# Altium schematic sheet MCU.SchDoc
size A3; SheetNumber: 4; SheetTotal: 7
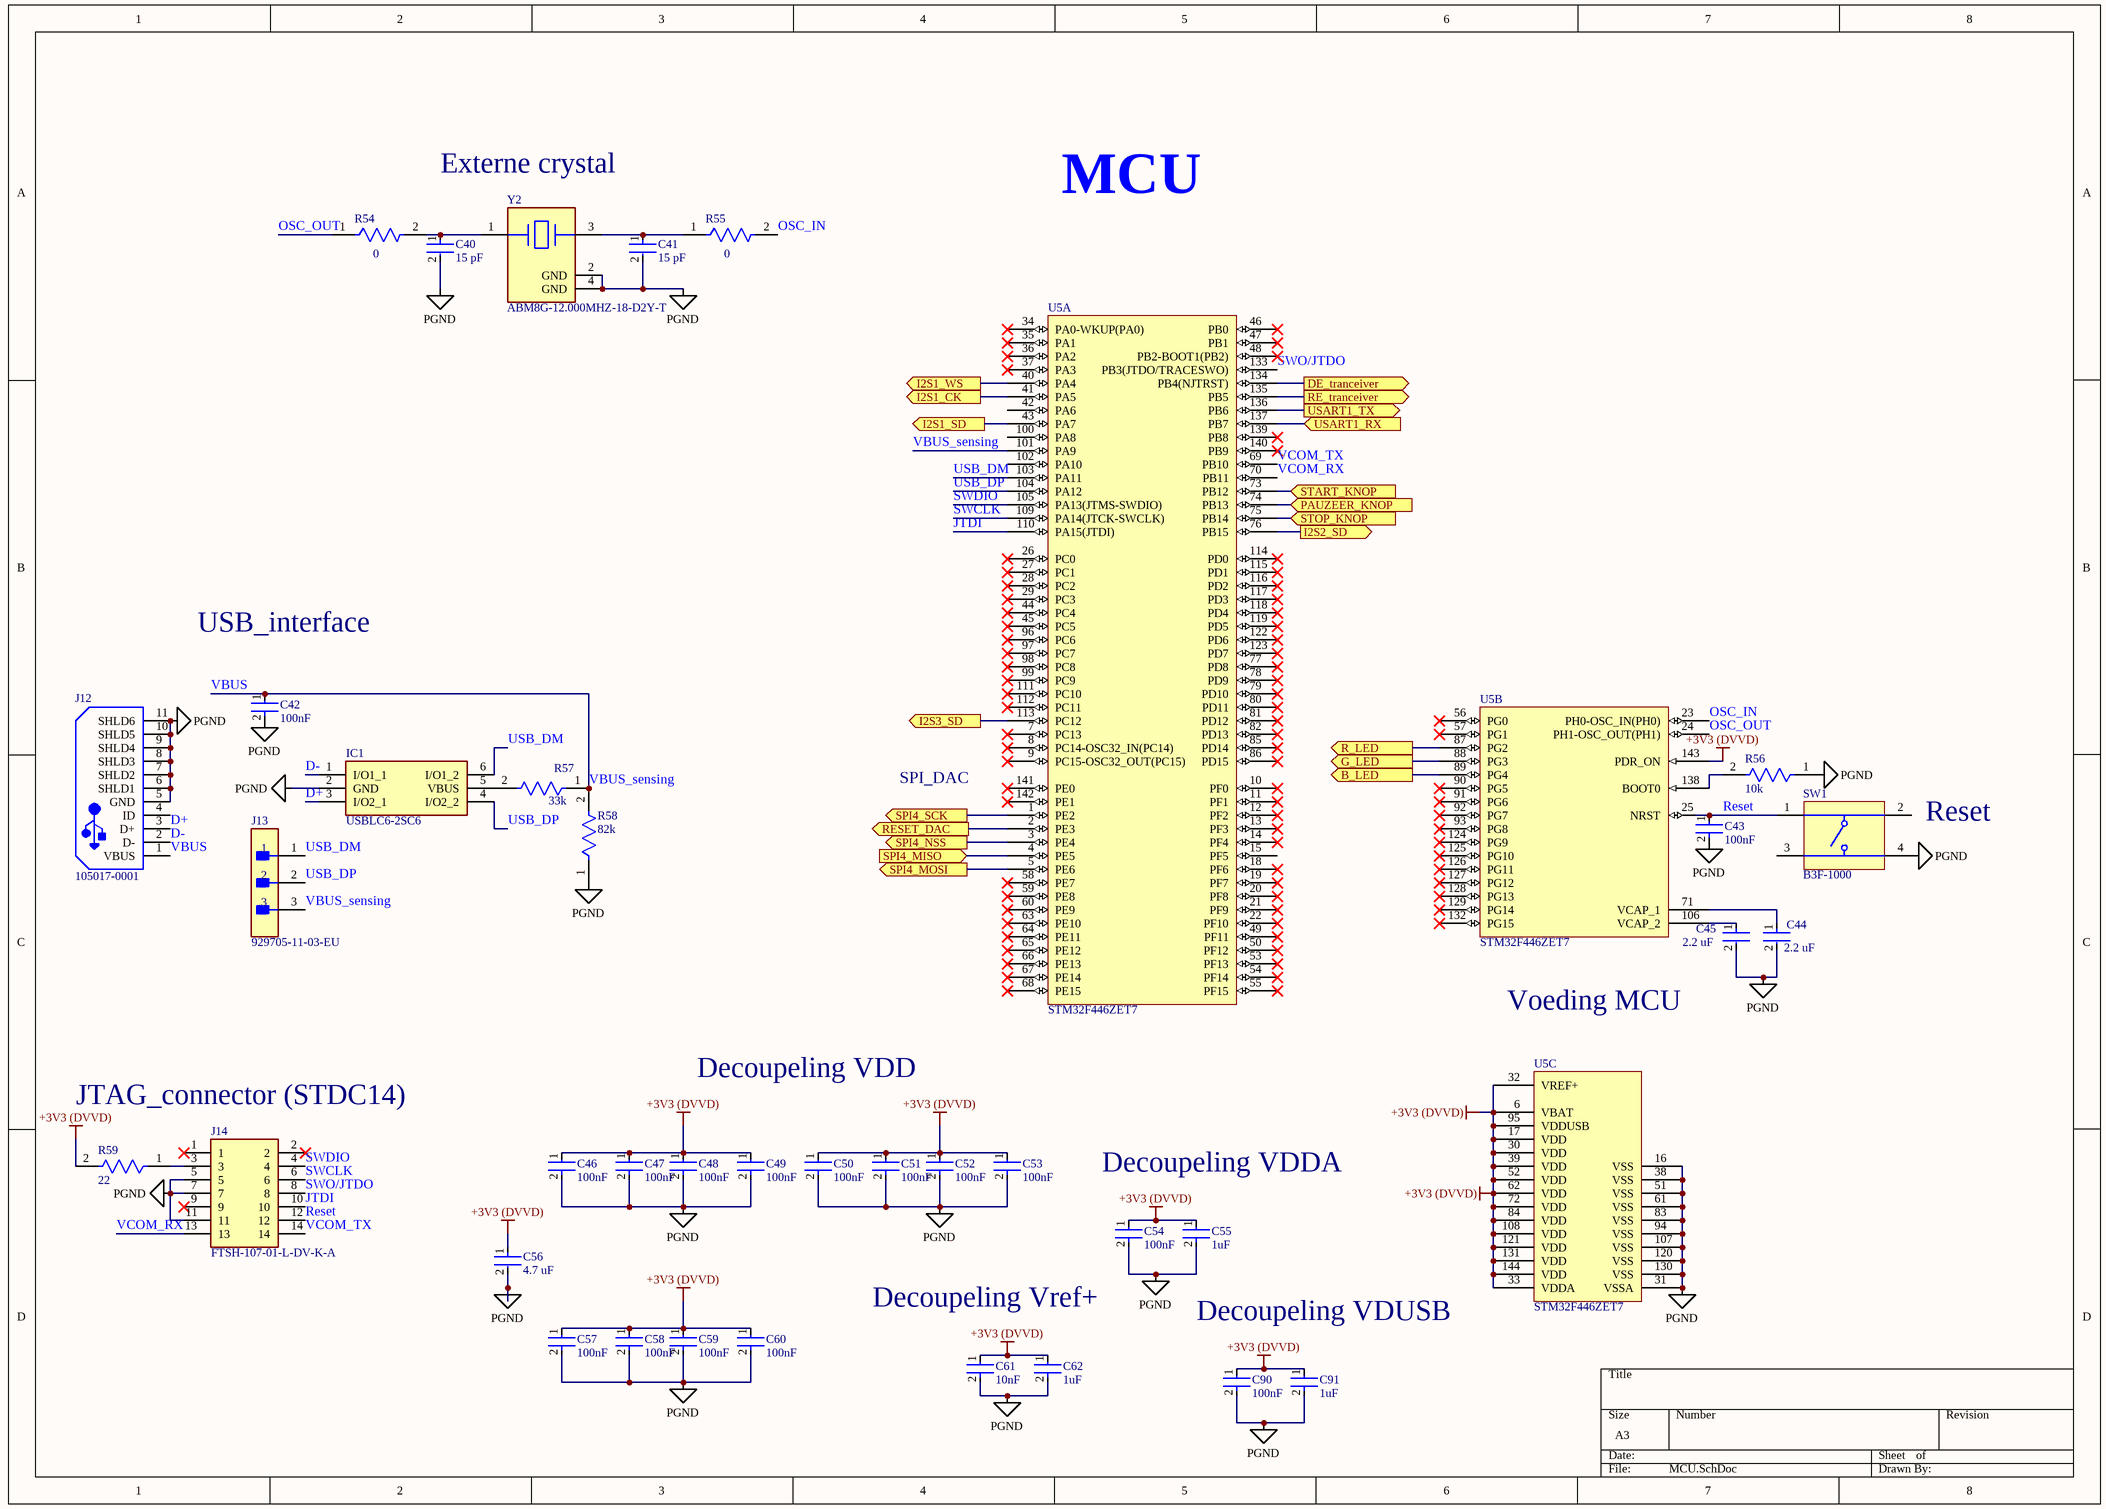
[diagram p0: MCU.SchDoc]

## Parts
C40  15 pF  [FP-AC0603-MFG]
C41  15 pF  [FP-AC0603-MFG]
C42  100nF  [FP-GRM15-MFG]
C43  100nF  [FP-GRM15-MFG]
C44  2.2 uF  [FP-C0603C-CF-MFG]
C45  2.2 uF  [FP-C0603C-CF-MFG]
C46  100nF  [FP-GRM15-MFG]
C47  100nF  [FP-GRM15-MFG]
C48  100nF  [FP-GRM15-MFG]
C49  100nF  [FP-GRM15-MFG]
C50  100nF  [FP-GRM15-MFG]
C51  100nF  [FP-GRM15-MFG]
C52  100nF  [FP-GRM15-MFG]
C53  100nF  [FP-GRM15-MFG]
C54  100nF  [FP-GRM15-MFG]
C55  1uF  [FP-GRM15-MFG]
C56  4.7 uF  [FP-C0603C-CF-MFG]
C57  100nF  [FP-GRM15-MFG]
C58  100nF  [FP-GRM15-MFG]
C59  100nF  [FP-GRM15-MFG]
C60  100nF  [FP-GRM15-MFG]
C61  10nF  [FP-GRM15-MFG]
C62  1uF  [FP-GRM15-MFG]
C90  100nF  [FP-GRM15-MFG]
C91  1uF  [FP-GRM15-MFG]
IC1  USBLC6-2SC6  [SOT95P280X145-6N]
J12  105017-0001  [USB-MICRO-B_V]
J13  929705-11-03-EU  [FP-929705-11-03-EU-MFG]
J14  FTSH-107-01-L-DV-K-A  [FTSH-107-XX-YYY-DV-K-A]
R54  0  [FP-CRCW1206-MFG]
R55  0  [FP-CRCW1206-MFG]
R56  10k  [FP-RC1608-IPC_B]
R57  33k  [FP-RC1608-IPC_B]
R58  82k  [FP-RC1608-IPC_B]
R59  22  [FP-RC1608-IPC_B]
SW1  B3F-1000  [OMRON-B3F-1000-4_V]
U5  STM32F446ZET7  [STM-LQFP144_M]  (parts A,B,C of 3)
Y2  ABM8G-12.000MHZ-18-D2Y-T  [FP-ABM8G-MFG]

## Ports
B_LED (out, see TOP_scheet[3C]), DE_tranceiver (out, see TOP_scheet[3C]), G_LED (out, see TOP_scheet[3C]), I2S1_CK (out, see TOP_scheet[3B]), I2S1_SD (out, see TOP_scheet[3B], DAC[1C]), I2S1_WS (out, see TOP_scheet[3B]), I2S2_SD (out, see TOP_scheet[3B], DAC[1C]), I2S3_SD (out, see TOP_scheet[3B], DAC[1C]), PAUZEER_KNOP (in, see TOP_scheet[2B]), R_LED (out, see TOP_scheet[3C]), RE_tranceiver (out, see TOP_scheet[3C]), RESET_DAC (out, see TOP_scheet[2B]), SPI4_MISO (in, see TOP_scheet[3C]), SPI4_MOSI (out, see TOP_scheet[3C]), SPI4_NSS (out, see TOP_scheet[3C]), SPI4_SCK (out, see TOP_scheet[3B]), START_KNOP (in, see TOP_scheet[2B]), STOP_KNOP (in, see TOP_scheet[2B]), USART1_RX (in, see TOP_scheet[2C]), USART1_TX (out, see TOP_scheet[3C])

## Nets
+3V3 (DVVD): C46.1 C47.1 C48.1 C49.1 C50.1 C51.1 C52.1 C53.1 C54.1 C55.1 C56.1 C57.1 C58.1 C59.1 C60.1 C61.1 C62.1 C90.1 C91.1 R59.2 U5.6(VBAT) U5.17(VDD) U5.30(VDD) U5.32(VREF+) U5.33(VDDA) U5.39(VDD) U5.52(VDD) U5.62(VDD) U5.72(VDD) U5.84(VDD) U5.95(VDDUSB) U5.108(VDD) U5.121(VDD) U5.131(VDD) U5.143(PDR_ON) U5.144(VDD)
PGND: C40.2 C41.2 C42.2 C43.2 C44.2 C45.2 C46.2 C47.2 C48.2 C49.2 C50.2 C51.2 C52.2 C53.2 C54.2 C55.2 C56.2 C57.2 C58.2 C59.2 C60.2 C61.2 C62.2 C90.2 C91.2 IC1.2(GND) J12.5(GND) J12.6(SHLD1) J12.7(SHLD2) J12.8(SHLD3) J12.9(SHLD4) J12.10(SHLD5) J12.11(SHLD6) J14.5 J14.7 J14.11 R56.1 R58.1 SW1.4 U5.16(VSS) U5.31(VSSA) U5.38(VSS) U5.51(VSS) U5.61(VSS) U5.83(VSS) U5.94(VSS) U5.107(VSS) U5.120(VSS) U5.130(VSS) Y2.2(GND) Y2.4(GND)
B_LED: U5.89(PG4) ; port B_LED
D+: IC1.3(I/O2_1) J12.3(D+)
D-: IC1.1(I/O1_1) J12.2(D-)
DE_tranceiver: U5.134(PB4(NJTRST)) ; port DE_tranceiver
G_LED: U5.88(PG3) ; port G_LED
I2S1_CK: U5.41(PA5) ; port I2S1_CK
I2S1_SD: U5.43(PA7) ; port I2S1_SD
I2S1_WS: U5.40(PA4) ; port I2S1_WS
I2S2_SD: U5.76(PB15) ; port I2S2_SD
I2S3_SD: U5.113(PC12) ; port I2S3_SD
JTDI: J14.10 U5.110(PA15(JTDI))
OSC_IN: R55.2 U5.23(PH0-OSC_IN(PH0))
OSC_OUT: R54.1 U5.24(PH1-OSC_OUT(PH1))
PAUZEER_KNOP: U5.74(PB13) ; port PAUZEER_KNOP
R_LED: U5.87(PG2) ; port R_LED
RE_tranceiver: U5.135(PB5) ; port RE_tranceiver
Reset: C43.1 J14.12 SW1.1 U5.25(NRST)
RESET_DAC: U5.2(PE3) ; port RESET_DAC
SPI4_MISO: U5.4(PE5) ; port SPI4_MISO
SPI4_MOSI: U5.5(PE6) ; port SPI4_MOSI
SPI4_NSS: U5.3(PE4) ; port SPI4_NSS
SPI4_SCK: U5.1(PE2) ; port SPI4_SCK
START_KNOP: U5.73(PB12) ; port START_KNOP
STOP_KNOP: U5.75(PB14) ; port STOP_KNOP
SWCLK: J14.6 U5.109(PA14(JTCK-SWCLK))
SWDIO: J14.4 U5.105(PA13(JTMS-SWDIO))
SWO/JTDO: J14.8 U5.133(PB3(JTDO/TRACESWO))
USART1_RX: U5.137(PB7) ; port USART1_RX
USART1_TX: U5.136(PB6) ; port USART1_TX
USB_DM: IC1.6(I/O1_2) J13.1 U5.103(PA11)
USB_DP: IC1.4(I/O2_2) J13.2 U5.104(PA12)
VBUS: C42.1 J12.1(VBUS) J13.3 R57.1 R58.2 U5.101(PA9)  [also labelled VBUS_sensing]
VCOM_RX: J14.13 U5.70(PB11)
VCOM_TX: J14.14 U5.69(PB10)
NetC40_1: C40.1 R54.2 Y2.1
NetC41_1: C41.1 R55.1 Y2.3
NetC44_1: C44.1 U5.71(VCAP_1)
NetC45_1: C45.1 U5.106(VCAP_2)
NetIC1_5: IC1.5(VBUS) R57.2
NetJ14_3: J14.3 R59.1
NetR56_2: R56.2 U5.138(BOOT0)

Not connected (* = marked no-connect by the designer): J12 4(ID); J14 1* 2* 9*; SW1 2 3; U5 7(PC13)* 8(PC14-OSC32_IN(PC14))* 9(PC15-OSC32_OUT(PC15))* 10(PF0)* 11(PF1)* 12(PF2)* 13(PF3)* 14(PF4)* 15(PF5) 18(PF6)* 19(PF7)* 20(PF8)* 21(PF9)* 22(PF10)* 26(PC0)* 27(PC1)* 28(PC2)* 29(PC3)* 34(PA0-WKUP(PA0))* 35(PA1)* 36(PA2)* 37(PA3)* 42(PA6) 44(PC4)* 45(PC5)* 46(PB0)* 47(PB1)* 48(PB2-BOOT1(PB2))* 49(PF11)* 50(PF12)* 53(PF13)* 54(PF14)* 55(PF15)* 56(PG0)* 57(PG1)* 58(PE7)* 59(PE8)* 60(PE9)* 63(PE10)* 64(PE11)* 65(PE12)* 66(PE13)* 67(PE14)* 68(PE15)* 77(PD8)* 78(PD9)* 79(PD10)* 80(PD11)* 81(PD12)* 82(PD13)* 85(PD14)* 86(PD15)* 90(PG5)* 91(PG6)* 92(PG7)* 93(PG8)* 96(PC6)* 97(PC7)* 98(PC8)* 99(PC9)* 100(PA8) 102(PA10) 111(PC10)* 112(PC11)* 114(PD0)* 115(PD1)* 116(PD2)* 117(PD3)* 118(PD4)* 119(PD5)* 122(PD6)* 123(PD7)* 124(PG9)* 125(PG10)* 126(PG11)* 127(PG12)* 128(PG13)* 129(PG14)* 132(PG15)* 139(PB8)* 140(PB9)* 141(PE0)* 142(PE1)*

## Notes on the sheet
- Externe crystal
- MCU
- USB_interface
- SPI_DAC
- (near SW1) Reset
- Voeding MCU
- JTAG_connector (STDC14)
- Decoupeling VDD
- Decoupeling VDDA
- Decoupeling Vref+
- Decoupeling VDUSB

## Library data of the parts
C40 C41 = CMP-03422-001062-1: AC0603 15 pF NP0 5.00% 50 V; Manufacturer Part Number: AC0603JRNPO9BN271; Manufacturer: Yageo; Generic part Eurocircuits:: GPC0603150; Material: Ceramic; Value: 30 pF; Tolerance: 0.05; Voltage Rating: 50 V; Temperature Coefficient: 15%; Automotive Grade: Grade 1; ComponentLink2URL: http://www.yageo.com/documents/recent/UPY-AC_NP0X7R_16V-to-630V_12.pdf; Capacitance: 30 pF; Lead Free: Yes; Automotive: Yes; Package: AC0603; RoHS: TRUE; Device Class L2: Capacitors; Footprint Url: http://www.yageo.com/exep/pages/download/literatures/UPY-C_GEN_24.pdf; Height: 0.9mm; Category: Cap; Device Class L1: Passive Components; Temperature: -55°C to +125°C; Ipc Land Pattern Name: CAPC16080X80; Octopart: https://octopart.com/ac0603jrnpo9bn271-yageo-87214073; ComponentLink2Description: Datasheet; Device Class L3: Ceramic Capacitors; Temperature Characteristic: NP0; Temperature Range High: +125°C; Temperature Range Low: -55°C
C42 C43 C46-C54 C57-C60 C90 = CMP-2100-03641-2: CAP CER 0.1UF 16V X7R 0402; Manufacturer Part Number: GRM155R71C104KA88D; Manufacturer: Murata; Eurocircuits generic parts: GPC0402104; Standoff Height: 0mm; Tolerance: 10%; Voltage Rating: 16Vdc; Material: Ceramic; Capacitance: 0.10μF; Value: 0.10μF; RoHS: TRUE; Temperature Characteristic: X7R; Octopart: https://octopart.com/grm155r71c104ka88d-murata-196880; Digikey Description: CAP CER 0.1UF 16V X7R 0402; Device Class L3: Ceramic Capacitors; Height: 0.55mm; ComponentLink2Description: Datasheet; Temperature Range Low: -55°C; Ipc Land Pattern Name: CAPC10050X219; ComponentLink2URL: https://search.murata.co.jp/Ceramy/image/img/A01X/G101/ENG/GRM155R71H471KA01-01A.pdf; Device Class L1: Passive Components; Lead Free: yes; Category: Cap; Package: GRM15; Temperature: -55°C to +125°C; Device Class L2: Capacitors; Temperature Range High: +125°C; Mouser Description: 0402 0.1 uF 16V ±10 % Tolerance X7R SMT Multilayer Ceramic Capacitor
C44 C45 = CMP-2006-03056-2: CAP CER 2.2 UF 50V 5% X7R 0603; Manufacturer Part Number: C0603C104J5RACTU; Manufacturer: KEMET; Generic part Eurocircuits:: GPC0603225-10; Automotive Grade: Grade 1; Tolerance: 0.05; Capacitance: 2.2 μF; Value: 2.2 μF; Material: Ceramic; Temperature Coefficient: 30ppm/°C; ComponentLink2Description: Datasheet; Voltage Rating: 50 V; Digikey Description: CAP CER 0.1UF 50V 5% X7R 0603; Temperature Range High: +125°C; Device Class L2: Capacitors; Octopart: https://octopart.com/c0603c104j5ractu-kemet-10440638; RoHS: TRUE; Mouser Description: Multilayer Ceramic Capacitors MLCC - SMD/SMT 50volts 0.1uF X7R 5%; Temperature Range Low: -55°C; Automotive: Yes; Lead Free: Yes; ComponentLink2URL: https://api.kemet.com/component-edge/download/datasheet/C0603C100J5GACAUTO.pdf; Device Class L3: Ceramic Capacitors; Package: C0603C-CF; Category: Cap; Temperature: -55°C to +125°C; Height: 0.87mm; Temperature Characteristic: X7R; Device Class L1: Passive Components
C55 C62 C91 = CMP-2100-03641-2: CAP CER 1UF 16V X7R 0402; Manufacturer Part Number: GRM155R71C104KA88D; Manufacturer: Murata; Eurocircuits generic parts: GPC0402105-16; Standoff Height: 0mm; Tolerance: 10%; Voltage Rating: 16Vdc; Material: Ceramic; Capacitance: 1μF; Value: 1μF; RoHS: TRUE; Temperature Characteristic: X7R; Octopart: https://octopart.com/grm155r71c104ka88d-murata-196880; Digikey Description: CAP CER 0.1UF 16V X7R 0402; Device Class L3: Ceramic Capacitors; Height: 0.55mm; ComponentLink2Description: Datasheet; Temperature Range Low: -55°C; Ipc Land Pattern Name: CAPC10050X219; ComponentLink2URL: https://search.murata.co.jp/Ceramy/image/img/A01X/G101/ENG/GRM155R71H471KA01-01A.pdf; Device Class L1: Passive Components; Lead Free: yes; Category: Cap; Package: GRM15; Temperature: -55°C to +125°C; Device Class L2: Capacitors; Temperature Range High: +125°C; Mouser Description: 0402 0.1 uF 16V ±10 % Tolerance X7R SMT Multilayer Ceramic Capacitor
C56 = CMP-2006-03056-2: CAP CER 4.7 UF 50V 5% X7R 0603; Manufacturer Part Number: C0603C104J5RACTU; Manufacturer: KEMET; Generic part Eurocircuits:: GPC0603475-10; Automotive Grade: Grade 1; Tolerance: 0.05; Capacitance: 4.7 μF; Value: 4.7 μF; Material: Ceramic; Temperature Coefficient: 30ppm/°C; ComponentLink2Description: Datasheet; Voltage Rating: 50 V; Digikey Description: CAP CER 0.1UF 50V 5% X7R 0603; Temperature Range High: +125°C; Device Class L2: Capacitors; Octopart: https://octopart.com/c0603c104j5ractu-kemet-10440638; RoHS: TRUE; Mouser Description: Multilayer Ceramic Capacitors MLCC - SMD/SMT 50volts 0.1uF X7R 5%; Temperature Range Low: -55°C; Automotive: Yes; Lead Free: Yes; ComponentLink2URL: https://api.kemet.com/component-edge/download/datasheet/C0603C100J5GACAUTO.pdf; Device Class L3: Ceramic Capacitors; Package: C0603C-CF; Category: Cap; Temperature: -55°C to +125°C; Height: 0.87mm; Temperature Characteristic: X7R; Device Class L1: Passive Components
C61 = CMP-2100-03641-2: CAP CER 10nF 16V X7R 0402; Manufacturer Part Number: GRM155R71C104KA88D; Manufacturer: Murata; Eurocircuits generic parts: GPC0402103; Standoff Height: 0mm; Tolerance: 10%; Voltage Rating: 16Vdc; Material: Ceramic; RoHS: TRUE; Temperature Characteristic: X7R; Octopart: https://octopart.com/grm155r71c104ka88d-murata-196880; Digikey Description: CAP CER 0.1UF 16V X7R 0402; Device Class L3: Ceramic Capacitors; Height: 0.55mm; ComponentLink2Description: Datasheet; Temperature Range Low: -55°C; Ipc Land Pattern Name: CAPC10050X219; ComponentLink2URL: https://search.murata.co.jp/Ceramy/image/img/A01X/G101/ENG/GRM155R71H471KA01-01A.pdf; Device Class L1: Passive Components; Lead Free: yes; Category: Cap; Package: GRM15; Temperature: -55°C to +125°C; Device Class L2: Capacitors; Capacitance: 10nF; Value: 10nF; Temperature Range High: +125°C; Mouser Description: 0402 0.1 uF 16V ±10 % Tolerance X7R SMT Multilayer Ceramic Capacitor; Parameter 1: *
IC1 = USBLC6-2SC6: ESD-onderdrukkers/TVS-diodes ESD Protection Low Cap; Manufacturer_Name: STMicroelectronics; Bedrijfsspanning:: 5.25 V; Klemspanning:: 17 V; Doorslagspanning:: 6 V; Datasheet Link: http://www.st.com/st-web-ui/static/active/en/resource/technical/document/datasheet/CD00050750.pdf; Height: 1.45mm; Manufacturer_Part_Number: USBLC6-2SC6; Mouser Part Number: 511-USBLC6-2SC6; Mouser Price/Stock: https://www.mouser.co.uk/ProductDetail/STMicroelectronics/USBLC6-2SC6?qs=po45yt2pPpu%2FhNIlwQdTlg%3D%3D; Arrow Part Number: USBLC6-2SC6; Arrow Price/Stock: https://www.arrow.com/en/products/usblc6-2sc6/stmicroelectronics?region=nac
J12 = CMP-2000-05827-1: Micro-USB B Receptacle, Right Angle, Bottom Mount, Surface Mount, with Solder Tabs, -30 to 85 degC, 5-Pin USB, RoHS, Tape and Reel; Manufacturer: Molex; Featured Product: Micro-USBConnectorsUSBConnectors; Other Names: WM1399DKR; Package Version: Rev. F, 12/2012; Number of Contacts: 5; Connector Type: USB-microB; Catalog Drawings: 1050170001; 3D Model: 105017-0001.stp; Mating Products: WM17145-ND-CABLEMICROUSBBTOSTDA1.0MWM17147-ND-CABLEMICROUSBBTOSTDA2.0MWM17146-ND-CABLEMICROUSBBTOSTDA1.5M; PCN Assembly/Origin: ResinSupplier21/Oct/2015; Voltage - Max: 30V; Online Catalog: Molex-MicroUSB; Manufacturer URL: http://www.molex.com/; Package Description: 5-Leads USB, Micro B, Body 7.5 x 5 mm, Pitch 0.65 mm; Datasheet URL: http://www.molex.com/elqNow/elqRedir.htm?ref=http://www.molex.com/webdocs/datasheets/pdf/en-us/1050170001_IO_CONNECTORS.pdf; Ingress Protection: -; Datasheet Version: 03/2016; Mounting Type: BoardCutout,SurfaceMount,RightAngle; Circuits: 5; Standard Package: 1; Package Reference: MICRO-B; Package URL: http://www.molex.com/pdm_docs/sd/1050170001_sd.pdf; Category: Connectors,Interconnects; Series: -; RoHS Information: 1050170001CertofCompliance; Features: Shielded,SolderRetention; Family: USB,DVI,HDMIConnectors; Specifications: -; Gender: Receptacle; Packaging: Digi-Reel®; Mounting Technology: SurfaceMount
J13 = CMP-05379-000017-1: CONN HEADER VERT 3POS 2.54MM / Euro circruits generic component: / GPHA-1X03; Gender: Male; Connector Type: Male Pin; Current Rating: 2.5A; Voltage Rating: 1.5kV; Number of Positions: 3; Orientation: Straight; Color: Black; Contact Material: Copper Alloy; Housing Color: Black; Series: 929; Contact Plating: Gold; Depth: 2.92mm; Max Current Rating: 2.5A; Mount: Through Hole; Number of Rows: 1; Min Operating Temperature: -40°C; Termination: Solder; Package Quantity: 100; Max Operating Temperature: 105°C; Contact Gender: Male; Length: 7.6mm; Contact Type: Male Pin; Contact Mating Length: 0.318inch; Housing Material: Polycyclohexylenedimethylene; Pitch: 2.54mm; RoHS Compliant: Yes; Packaging: Bulk; Eurocircuits_generic_part_number: GPHA-1X03
J14 = FTSH-107-01-L-DV-K-A: Board Connector, 14 Contact(s), 2 Row(s), Male, Straight, 0.05 inch Pitch, Surface Mount Terminal, Locking, Receptacle; Manufacturer_Name: SAMTEC; Pitch: 1.27mm; Number of Contacts: 14; Datasheet Link: http://suddendocs.samtec.com/prints/ftsh-1xx-xx-xxx-dv-xxx-xxx-mkt.pdf; Manufacturer_Part_Number: FTSH-107-01-L-DV-K-A; Mouser Part Number: 200-FTSH10701LDVKA; Mouser Price/Stock: https://www.mouser.co.uk/ProductDetail/Samtec/FTSH-107-01-L-DV-K-A?qs=PB6%2FjmICvI3xEHFou4PhNg%3D%3D; Arrow Part Number: FTSH-107-01-L-DV-K-A; Arrow Price/Stock: https://www.arrow.com/en/products/ftsh-107-01-l-dv-k-a/samtec?region=europe; Gender: Male
R54 R55 = CMP-00030-39388935-1: CRCW12060000ZSTA Zero Ohm Resistor, Jumper, 1206 [3216 Metric], Thick Film, 250 mW, Surface Mount; Voltage Rating (DC): 200V; Max Power Dissipation: 250mW; Temperature Coefficient: 100ppm/°C; Resistance: 0Ω; Packaging: Cut Tape; Lead Free: Contains Lead; Height: 609.6µm; Military Standard: Not; Min Operating Temperature: -55°C; Weight: 10.007382mg; Depth: 1.6mm; Termination: SMD/SMT; Mount: Surface Mount; RoHS: Compliant; Case Code (Metric): 3216; Max Operating Temperature: 155°C; NexarPartId: 39388935; Length: 3.2mm; Features: Automotive AEC-Q200; Case Code (Imperial): 1206; Composition: Thick Film; Case/Package: 1206; Voltage Rating: 200V; Width: 1.6mm; Contact Plating: Lead, Tin; Number of Terminations: 2; REACH SVHC: Unknown; Power Rating: 250mW; Radiation Hardening: No
R56 = CMP-13261-004935-1: Res Thick Film 0603 10kΩ 1% 0.1W ±100ppm/°C Molded SMD T/R / Generic part Eurocircuits: / GPR060310K; Voltage Rating (DC): 50V; Power Rating: 100mW; Resistance: 10k; Contact Plating: Tin; Depth: 0.8mm; Width: 800um; Tolerance: 1%; Lead Free: Lead Free; Composition: Thick Film; Military Standard: Not; Temperature Coefficient: 100ppm/°C; Radiation Hardening: No; Length: 1.6mm; Case/Package: 0603; Max Operating Temperature: 155°C; Packaging: Tape and Reel; Min Operating Temperature: -55°C; Generic part Eurocircuits:: GPR060310K
R57 = CMP-13261-004935-1: Res Thick Film 0603 33kΩ 1% 0.1W ±100ppm/°C Molded SMD T/R / Generic part Eurocircuits: / GPR060310K; Generic part Eurocircuits:: GPR060333K; Voltage Rating (DC): 50V; Power Rating: 100mW; Resistance: 33k; Contact Plating: Tin; Depth: 0.8mm; Width: 800um; Tolerance: 1%; Lead Free: Lead Free; Composition: Thick Film; Military Standard: Not; Temperature Coefficient: 100ppm/°C; Radiation Hardening: No; Length: 1.6mm; Case/Package: 0603; Max Operating Temperature: 155°C; Packaging: Tape and Reel; Min Operating Temperature: -55°C
R58 = CMP-13261-004935-1: Res Thick Film 0603 82kΩ 1% 0.1W ±100ppm/°C Molded SMD T/R / Generic part Eurocircuits: / GPR060310K; Generic part Eurocircuits:: GPR060382K; Voltage Rating (DC): 50V; Power Rating: 100mW; Resistance: 82k; Contact Plating: Tin; Depth: 0.8mm; Width: 800um; Tolerance: 1%; Lead Free: Lead Free; Composition: Thick Film; Military Standard: Not; Temperature Coefficient: 100ppm/°C; Radiation Hardening: No; Length: 1.6mm; Case/Package: 0603; Max Operating Temperature: 155°C; Packaging: Tape and Reel; Min Operating Temperature: -55°C
R59 = CMP-13261-004935-1: Res Thick Film 0603 22Ω 1% 0.1W ±100ppm/°C Molded SMD T/R / Generic part Eurocircuits: / GPR060310K; Generic part Eurocircuits:: GPR060322R; Voltage Rating (DC): 50V; Power Rating: 100mW; Resistance: 22; Contact Plating: Tin; Depth: 0.8mm; Width: 800um; Tolerance: 1%; Lead Free: Lead Free; Composition: Thick Film; Military Standard: Not; Temperature Coefficient: 100ppm/°C; Radiation Hardening: No; Length: 1.6mm; Case/Package: 0603; Max Operating Temperature: 155°C; Packaging: Tape and Reel; Min Operating Temperature: -55°C
SW1 = CMP-1677-00002-1: Tactile Switch, SPST-NO, 0.05 A, 5 to 24 V, -25 to 70 degC, 4-Pin THD, RoHS, Bulk; Shielding: Shielded; Gender: Female; Capacitance: -45 f; Voltage Rating: 150 V; Current Rating: 1.5 A; Radiation Hardening: No; Contact Plating: Gold; Height: 14.99 mm; Min Operating Temperature: -40 degC; Packaging: Tray; ComponentLink2Description: Datasheet; ComponentLink1URL: http://www.omron.com/; Lead Pitch: 1.27 mm; RoHSCompliant: true; Pins: 8; PackageReference: B3F-1000; Width: 25.4 mm; Contact Material: Brass; ComponentLink2URL: http://www.omron.com/ecb/products/pdf/en-b3f.pdf; PackageDescription: 4-Pin Through Hole Device, Body 6 x 6 mm; DatasheetVersion: Jan-15; ComponentLink1Description: Manufacturer URL; Package Quantity: 1080; Mount: Through Hole; Length: 18.34 mm; Max Operating Temperature: 70 degC
U5 = CMP-0243-00227-1: ARM Cortex-M4 32-bit MCU+FPU, 512 KB Flash, 128 KB Internal RAM, 114 I/Os, 144-Pin LQFP, -40 to 105 degC, Tray; Operating Frequency(F) (Processor speed) (MHz): 180; FLASH Size (Prog) (kB): 512; D/A Converter: 2; Internal RAM Size (kB): 128; I/Os (High Current): 114; Supply Voltage(Vcc) min (V): 1.7; Package Reference: 144-Pin Low Profile Quad Flat Package, Body 20 x 20 mm, Pitch 0.5 mm; Package Description: LQFP144; DatasheetVersion: Rev. 6; ComponentLink2Description: Datasheet; Mounting Technology: Surface Mount; Packing: Tray; ComponentLink2URL: http://www.st.com/st-web-ui/static/active/en/resource/technical/document/datasheet/DM00141306.pdf; Core: ARM Cortex-M4; ComponentLink1URL: http://www.st.com/; ComponentLink1Description: Manufacturer URL
Y2 = CMP-2000-05039-3: Crystal 12MHz ±20ppm (Tol) ±30ppm (Stability) 18pF FUND 120Ω 4-Pin SMD T/R; Series Resistance: 120R; Max Operating Temperature: 85°C; Mount: Surface Mount; Width: 2.5mm; Series: ABM8G; Termination: SMD/SMT; Frequency Tolerance: 20ppm; Tolerance: 20ppm; Min Operating Temperature: -40°C; Operating Frequency: 12 MHz; Depth: 2.5mm; Load Capacitance: 18pF; Number of Pins: 4; Length: 3.2mm; Radiation Hardening: No; Frequency Stability: 30ppm; Height: 1mm; Packaging: Tape and Reel; Package Quantity: 1000; ESR (Equivalent Series Resistance): 120R; Lead Free: Lead Free; Frequency: 12MHz; Case/Package: CSMD